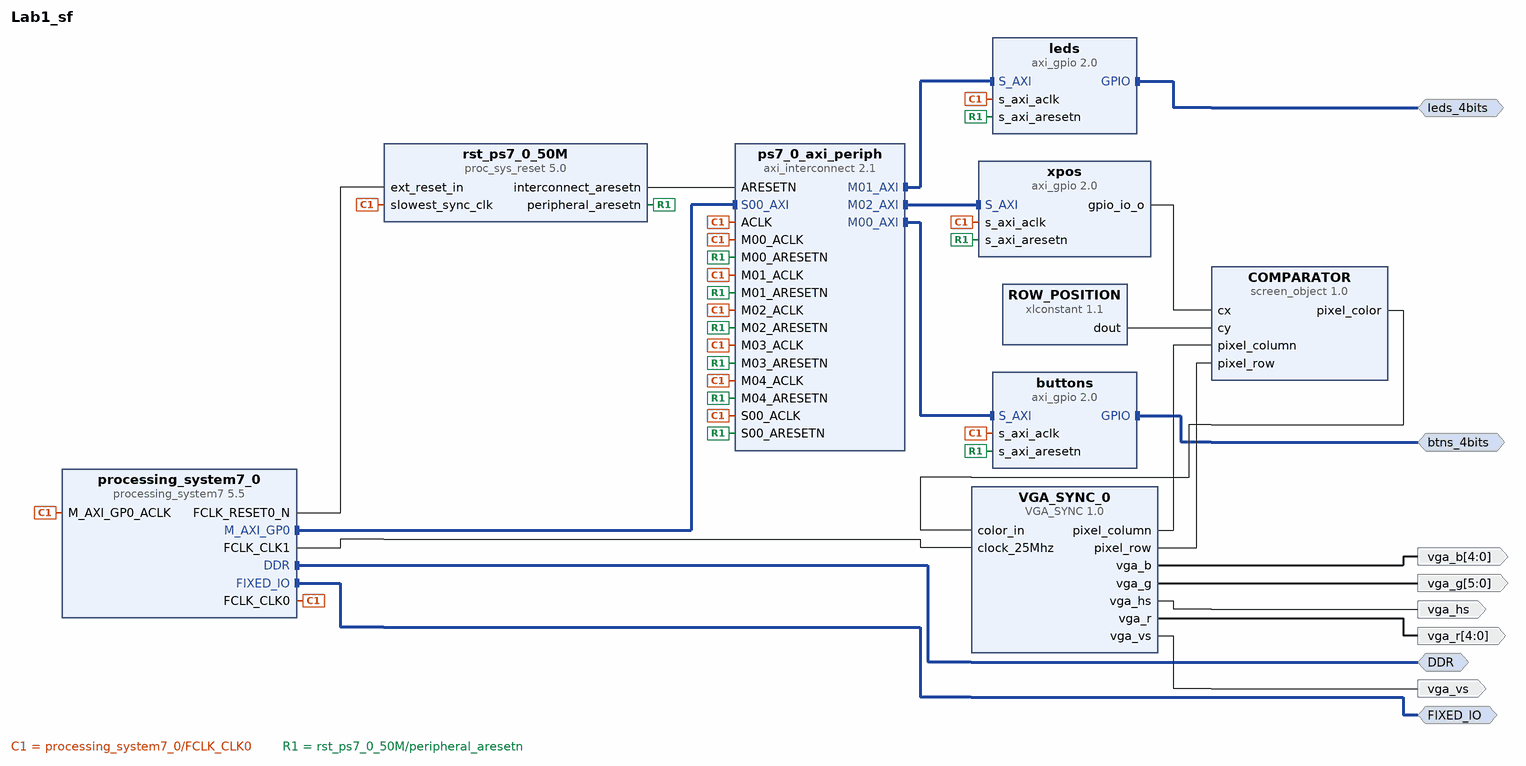
[diagram p0: block diagram of the top level]
# Vivado block design Lab1_sf, xc7z010clg400-1, Vivado 2017.2
create_bd_design Lab1_sf

create_bd_intf_port -mode Master -vlnv xilinx.com:interface:ddrx_rtl:1.0 DDR
create_bd_intf_port -mode Master -vlnv xilinx.com:display_processing_system7:fixedio_rtl:1.0 FIXED_IO
create_bd_intf_port -mode Master -vlnv xilinx.com:interface:gpio_rtl:1.0 btns_4bits
create_bd_intf_port -mode Master -vlnv xilinx.com:interface:gpio_rtl:1.0 leds_4bits
create_bd_port -dir O -from 4 -to 0 vga_b
create_bd_port -dir O -from 5 -to 0 vga_g
create_bd_port -dir O vga_hs
create_bd_port -dir O -from 4 -to 0 vga_r
create_bd_port -dir O vga_vs

create_bd_cell -type ip -vlnv xilinx.com:ip:processing_system7:5.5 processing_system7_0
set_property -dict [list \
  CONFIG.PCW_CRYSTAL_PERIPHERAL_FREQMHZ 50.000000 \
  CONFIG.PCW_FPGA0_PERIPHERAL_FREQMHZ 100 \
  CONFIG.PCW_FPGA1_PERIPHERAL_FREQMHZ 25 \
  CONFIG.PCW_EN_CLK1_PORT 1 \
] [get_bd_cells processing_system7_0]
create_bd_cell -type ip -vlnv xilinx.com:ip:axi_gpio:2.0 buttons
set_property -dict {CONFIG.USE_BOARD_FLOW true CONFIG.GPIO_BOARD_INTERFACE btns_4bits} [get_bd_cells buttons]
create_bd_cell -type ip -vlnv xilinx.com:ip:axi_gpio:2.0 leds
set_property -dict {CONFIG.USE_BOARD_FLOW true CONFIG.GPIO_BOARD_INTERFACE leds_4bits} [get_bd_cells leds]
create_bd_cell -type ip -vlnv xilinx.com:ip:axi_interconnect:2.1 ps7_0_axi_periph
set_property -dict {CONFIG.NUM_MI 5} [get_bd_cells ps7_0_axi_periph]
create_bd_cell -type ip -vlnv xilinx.com:ip:proc_sys_reset:5.0 rst_ps7_0_50M
create_bd_cell -type ip -vlnv user.org:user:VGA_SYNC:1.0 VGA_SYNC_0
create_bd_cell -type ip -vlnv user.org:user:screen_object:1.0 COMPARATOR
create_bd_cell -type ip -vlnv xilinx.com:ip:xlconstant:1.1 ROW_POSITION
set_property -dict {CONFIG.CONST_WIDTH 4 CONFIG.CONST_VAL 7} [get_bd_cells ROW_POSITION]
create_bd_cell -type ip -vlnv xilinx.com:ip:axi_gpio:2.0 xpos
set_property -dict {CONFIG.C_GPIO_WIDTH 4 CONFIG.C_ALL_INPUTS 0 CONFIG.C_ALL_OUTPUTS 1} [get_bd_cells xpos]

# ---- connections ----

connect_bd_intf_net [get_bd_intf_pins processing_system7_0/M_AXI_GP0] [get_bd_intf_pins ps7_0_axi_periph/S00_AXI]
connect_bd_intf_net [get_bd_intf_pins ps7_0_axi_periph/M00_AXI] [get_bd_intf_pins buttons/S_AXI]
connect_bd_intf_net [get_bd_intf_pins ps7_0_axi_periph/M01_AXI] [get_bd_intf_pins leds/S_AXI]
connect_bd_intf_net [get_bd_intf_pins ps7_0_axi_periph/M02_AXI] [get_bd_intf_pins xpos/S_AXI]
connect_bd_intf_net [get_bd_intf_ports DDR] [get_bd_intf_pins processing_system7_0/DDR]
connect_bd_intf_net [get_bd_intf_ports FIXED_IO] [get_bd_intf_pins processing_system7_0/FIXED_IO]
connect_bd_intf_net [get_bd_intf_ports btns_4bits] [get_bd_intf_pins buttons/GPIO]
connect_bd_intf_net [get_bd_intf_ports leds_4bits] [get_bd_intf_pins leds/GPIO]
connect_bd_net [get_bd_pins processing_system7_0/FCLK_CLK0] \
  [get_bd_pins processing_system7_0/M_AXI_GP0_ACLK] [get_bd_pins rst_ps7_0_50M/slowest_sync_clk] \
  [get_bd_pins buttons/s_axi_aclk] [get_bd_pins leds/s_axi_aclk] [get_bd_pins ps7_0_axi_periph/S00_ACLK] \
  [get_bd_pins ps7_0_axi_periph/M00_ACLK] [get_bd_pins ps7_0_axi_periph/ACLK] [get_bd_pins ps7_0_axi_periph/M01_ACLK] \
  [get_bd_pins ps7_0_axi_periph/M02_ACLK] [get_bd_pins ps7_0_axi_periph/M03_ACLK] [get_bd_pins ps7_0_axi_periph/M04_ACLK] \
  [get_bd_pins xpos/s_axi_aclk]
connect_bd_net [get_bd_pins processing_system7_0/FCLK_RESET0_N] [get_bd_pins rst_ps7_0_50M/ext_reset_in]
connect_bd_net [get_bd_pins rst_ps7_0_50M/peripheral_aresetn] \
  [get_bd_pins buttons/s_axi_aresetn] [get_bd_pins leds/s_axi_aresetn] [get_bd_pins ps7_0_axi_periph/S00_ARESETN] \
  [get_bd_pins ps7_0_axi_periph/M00_ARESETN] [get_bd_pins ps7_0_axi_periph/M01_ARESETN] \
  [get_bd_pins ps7_0_axi_periph/M02_ARESETN] [get_bd_pins ps7_0_axi_periph/M03_ARESETN] \
  [get_bd_pins ps7_0_axi_periph/M04_ARESETN] [get_bd_pins xpos/s_axi_aresetn]
connect_bd_net [get_bd_pins rst_ps7_0_50M/interconnect_aresetn] [get_bd_pins ps7_0_axi_periph/ARESETN]
connect_bd_net [get_bd_pins processing_system7_0/FCLK_CLK1] [get_bd_pins VGA_SYNC_0/clock_25Mhz]
connect_bd_net [get_bd_pins VGA_SYNC_0/vga_b] [get_bd_ports vga_b]
connect_bd_net [get_bd_pins VGA_SYNC_0/vga_g] [get_bd_ports vga_g]
connect_bd_net [get_bd_pins VGA_SYNC_0/vga_hs] [get_bd_ports vga_hs]
connect_bd_net [get_bd_pins VGA_SYNC_0/vga_r] [get_bd_ports vga_r]
connect_bd_net [get_bd_pins VGA_SYNC_0/vga_vs] [get_bd_ports vga_vs]
connect_bd_net -net screen_object_0_pixel_color [get_bd_pins COMPARATOR/pixel_color] [get_bd_pins VGA_SYNC_0/color_in]
connect_bd_net [get_bd_pins ROW_POSITION/dout] [get_bd_pins COMPARATOR/cy]
connect_bd_net [get_bd_pins VGA_SYNC_0/pixel_column] [get_bd_pins COMPARATOR/pixel_column]
connect_bd_net [get_bd_pins VGA_SYNC_0/pixel_row] [get_bd_pins COMPARATOR/pixel_row]
connect_bd_net -net readRow1_gpio_io_o [get_bd_pins xpos/gpio_io_o] [get_bd_pins COMPARATOR/cx]

# ---- address map ----
assign_bd_address -offset 0x41200000 -range 64K -target_address_space [get_bd_addr_spaces processing_system7_0/Data] [get_bd_addr_segs buttons/S_AXI/Reg]
assign_bd_address -offset 0x41210000 -range 64K -target_address_space [get_bd_addr_spaces processing_system7_0/Data] [get_bd_addr_segs leds/S_AXI/Reg]
assign_bd_address -offset 0x41220000 -range 64K -target_address_space [get_bd_addr_spaces processing_system7_0/Data] [get_bd_addr_segs xpos/S_AXI/Reg]

validate_bd_design
save_bd_design
